# Altium schematic sheet Power.SchDoc
size A
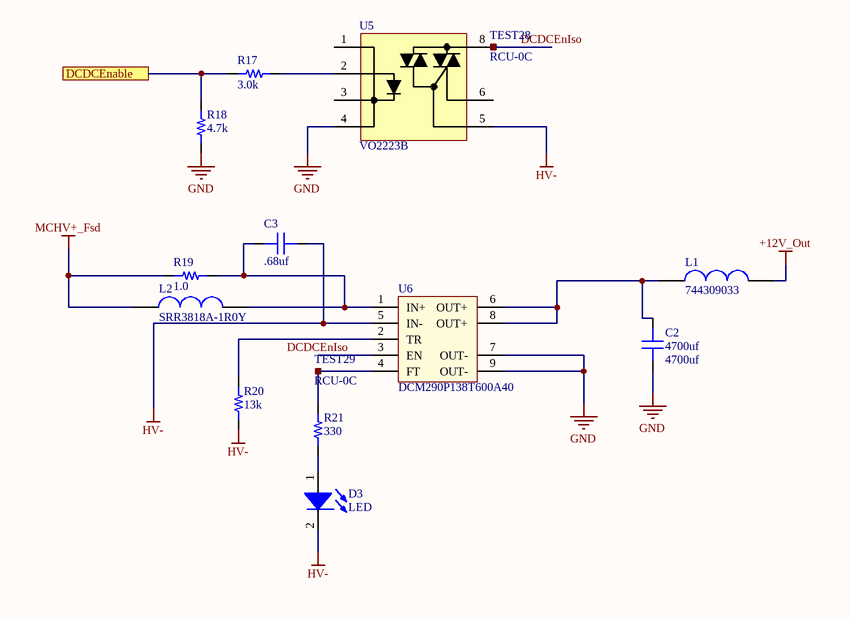
[diagram p0: Power.SchDoc]

## Parts
C2  4700uf  [CAP AL TH D16 L7.5 H16.5]
C3  value .68uf  [ECW-FD2W684K-TH-CAP]  (hidden comment: HV Cap)
D3  LED  [0805_LED]
L1  744309033  [744309033]
L2  SRR3818A-1R0Y  [SRR3818A-1R0Y]
R17  value 3.0k  [RES 0603/1608]  (hidden comment: Resistor 3.0k 0603 1/10W 1%)
R18  value 4.7k  [RES 0603/1608]  (hidden comment: Resistor 4.7k 0603 1/10W 1%)
R19  value 1.0  [RES 0603/1608]  (hidden comment: Resistor 1.0 0603 1/10W 1%)
R20  value 13k  [RES 0603/1608]  (hidden comment: Resistor 13k 0603 1/10W 1%)
R21  value 330  [RES 0603/1608]  (hidden comment: Resistor 330 0603 1/10W 1%)
TEST28  RCU-0C  [RCU-0C]
TEST29  RCU-0C  [RCU-0C]
U5  VO2223B  [Option 7]
U6  DCM290P138T600A40  [DCM290P138T600A40]

## Ports
DCDCEnable

## Nets
+12V_Out: L1.2
GND: C2.2 R18.1 U5.4 U6.7(OUT-) U6.9(OUT-)
HV-: C3.1 D3.2(K) R20.1 U5.5 U6.5(IN-)
MCHV+_Fsd: L2.1 R19.1
DCDCEnable: R17.1 R18.2 ; port DCDCEnable
DCDCEnIso: TEST28.1 U5.8 U6.3(EN)
NetC2_1: C2.1 L1.1 U6.6(OUT+) U6.8(OUT+)
NetC3_2: C3.2 L2.2 R19.2 U6.1(IN+)
NetD3_1: D3.1(A) R21.1
NetR17_2: R17.2 U5.2
NetR20_2: R20.2 U6.2(TR)
NetR21_2: R21.2 TEST29.1 U6.4(FT)

Not connected (* = marked no-connect by the designer): U5 1 3 6

## Library data of the parts
C2 = 1083: Manufacturer_id: 1; MfrPartNo: UVZ1E472MHD; idCapacitor: 1083; Name: Cap_4700uf_25V_CAP TH; Voltage_Rating: 25V; Tolerance: 20%; Created_By: Angel Delgado; Value: 4700uf; Drawer_id: 1; Package: TH; Link: https://www.digikey.com/product-detail/en/nichicon/UVZ1E472MHD/493-1308-ND/589049; ComponentLink1Description: Datasheet
C3 = 1082: Manufacturer_id: 1; MfrPartNo: ECW-FD2W684K; idCapacitor: 1082; Name: Cap_.68uf_450V_CAP TH; Voltage_Rating: 450V; Dielectric: Polypropylene; Tolerance: 10%; Created_By: Angel Delgado; Drawer_id: 1; Package: TH; Link: https://www.mouser.com/ProductDetail/Panasonic/ECW-FD2W684K?qs=sGAEpiMZZMsh%252b1woXyUXj8Oz95SkSMnKDNbVTfkAU30%3d; ComponentLink1Description: Datasheet
D3 = 1: idLED: 1; Name: LED_0805_RED; Value: Red; Vf: 0.7V; Manufacturer_id: 1; Drawer_id: 1; Package: 0805
L1 = 3: 330nH wirewound inductor; Manufacturer_id: 1; idInductor: 3; Created_By: Graydon; Drawer_id: 1; Name: 744309033; Value: 330nH; Package: Nonstandard; MfrPartNo: 744309033; Link: https://www.digikey.com/product-detail/en/wurth-electronics-inc/744309033/732-3006-1-ND/2626130; Supplier1: Digikey; Supplier1PartNo: 732-3006-1-ND; Created_Date: 11/12/2018
L2 = 4: 1uH fixed inductor; Manufacturer_id: 1; idInductor: 4; Created_By: Graydon; Drawer_id: 1; Name: SRR3818A-1R0Y; Value: 1uH; Package: Nonstandard; MfrPartNo: SRR3818A-1R0Y; Link: https://www.mouser.com/ProductDetail/Bourns/SRR3818A-1R0Y?qs=EU6FO9ffTwdCQ1wGwZI3iw%3D%3D; ComponentLink1Description: Mouser; ComponentLink1URL: https://www.mouser.com/ProductDetail/Bourns/SRR3818A-1R0Y?qs=EU6FO9ffTwdCQ1wGwZI3iw%3D%3D; Supplier1: Mouser; Supplier1PartNo: 652-SRR3818A-1R0Y; Created_Date: 11/12/2018
R17 = 300: Manufacturer_id: 1; idResistor: 300; Name: Res_3.0k_0603_1/10W_1%; Created_By: Nick Mah; Supplier 1: Digi-Key; Drawer_id: 1; Tolerance: 1%; Power: 1/10W; Package: 0603; ComponentLink1Description: Datasheet; Created_Date: 2018-10-20
R18 = 305: Manufacturer_id: 1; idResistor: 305; Name: Res_4.7k_0603_1/10W_1%; Created_By: Nick Mah; Supplier 1: Digi-Key; Drawer_id: 1; Tolerance: 1%; Power: 1/10W; Package: 0603; ComponentLink1Description: Datasheet; Created_Date: 2018-10-20
R19 = 217: Manufacturer_id: 1; idResistor: 217; Name: Res_1.0_0603_1/10W_1%; Created_By: Nick Mah; Supplier 1: Digi-Key; Drawer_id: 1; Tolerance: 1%; Power: 1/10W; Package: 0603; ComponentLink1Description: Datasheet; Created_Date: 2018-10-20
R20 = 316: Manufacturer_id: 1; idResistor: 316; Name: Res_13k_0603_1/10W_1%; Created_By: Nick Mah; Supplier 1: Digi-Key; Drawer_id: 1; Tolerance: 1%; Power: 1/10W; Package: 0603; ComponentLink1Description: Datasheet; Created_Date: 2018-10-20
R21 = 277: Manufacturer_id: 1; idResistor: 277; Name: Res_330_0603_1/10W_1%; Created_By: Nick Mah; Supplier 1: Digi-Key; Drawer_id: 1; Tolerance: 1%; Power: 1/10W; Package: 0603; ComponentLink1Description: Datasheet; Created_Date: 2018-10-20
TEST28 TEST29 = 14: Test point; Manufacturer_id: 1; idConn: 14; Value: CONN; Created_By: Graydon; Updated_By: Null; Drawer_id: 1; Name: RCU-0C; Num_Contacts: 1; Num_Rows: 1; Package: RCU-0C; MfrPartNo: RCU-0C; Link: https://www.digikey.com/product-detail/en/te-connectivity-amp-connectors/RCU-0C/A106145CT-ND/3477802; ComponentLink1Description: Null; ComponentLink1URL: Null; Supplier1: None; Supplier1PartNo: None; Created_Date: 11/10/2018
U5 = 19: Optocoupler, Power Phototriac; Manufacturer_id: 1; idIC_Misc: 19; Name: VO2223B Optocoupler; Drawer_id: 1
U6 = 24: Vicor DC/DC converter; Manufacturer_id: 1; idIC_Misc: 24; Value: Null; Created_By: Graydon; Drawer_id: 1; Name: DCM290P138T600A40; Type: Null; Protocol: Null; Num_Circuits: 1; Data_Rate: Null; Vin(Min): Null; Vin(Max): Null; MfrPartNo: DCM290P138T600A40; Link: http://www.vicorpower.com/documents/datasheets/ds_DCM290y138x600A40.pdf; Supplier1: Digikey; Supplier1PartNo: 1102-5388-ND